# Altium schematic sheet S7CAS-PLEIADES-CARTE-MERE_P06_POWER2.SCHDOC
size Tabloid; SheetNumber: 5; SheetTotal: 18; Sheet_Name: POWER 2; Size: 11x17
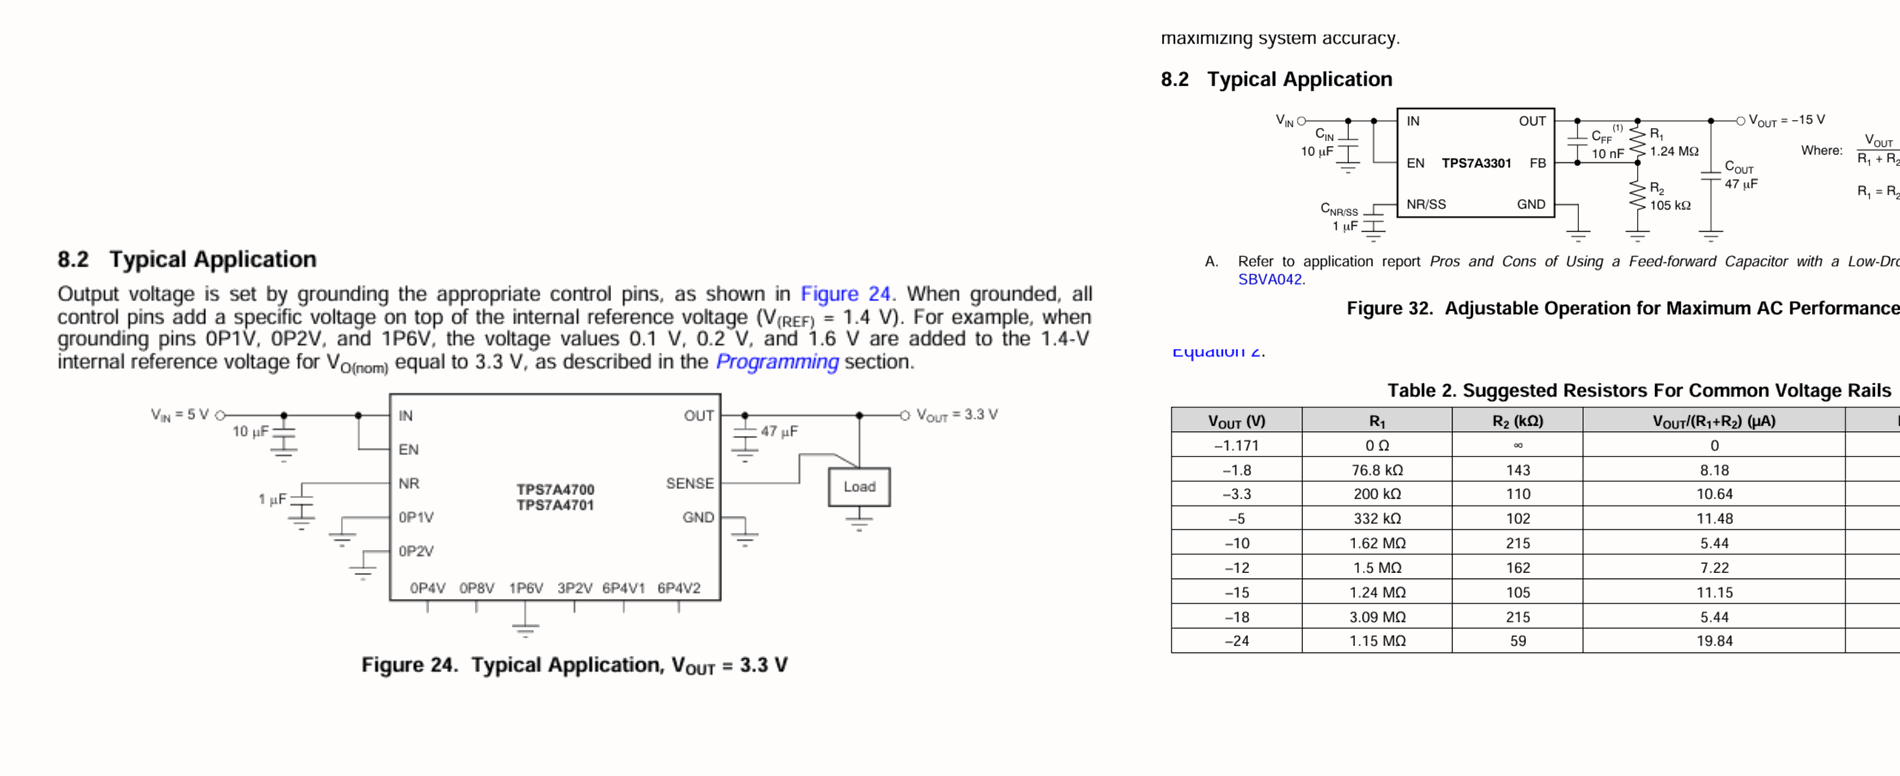
[diagram p0: S7CAS-PLEIADES-CARTE-MERE_P06_POWER2.SCHDOC, top left]
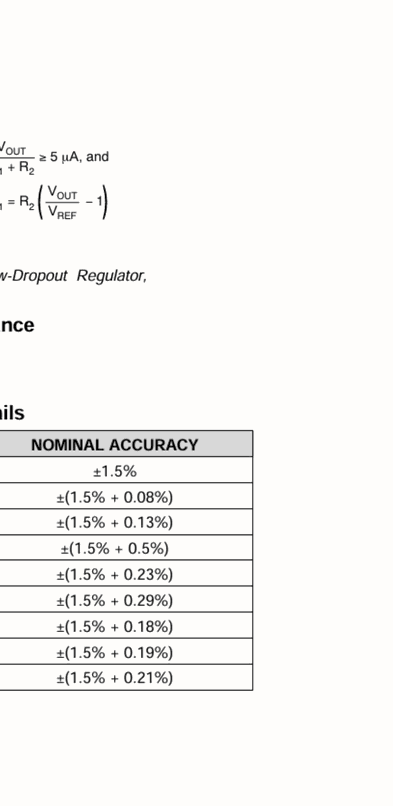
[diagram p1: S7CAS-PLEIADES-CARTE-MERE_P06_POWER2.SCHDOC, top right]
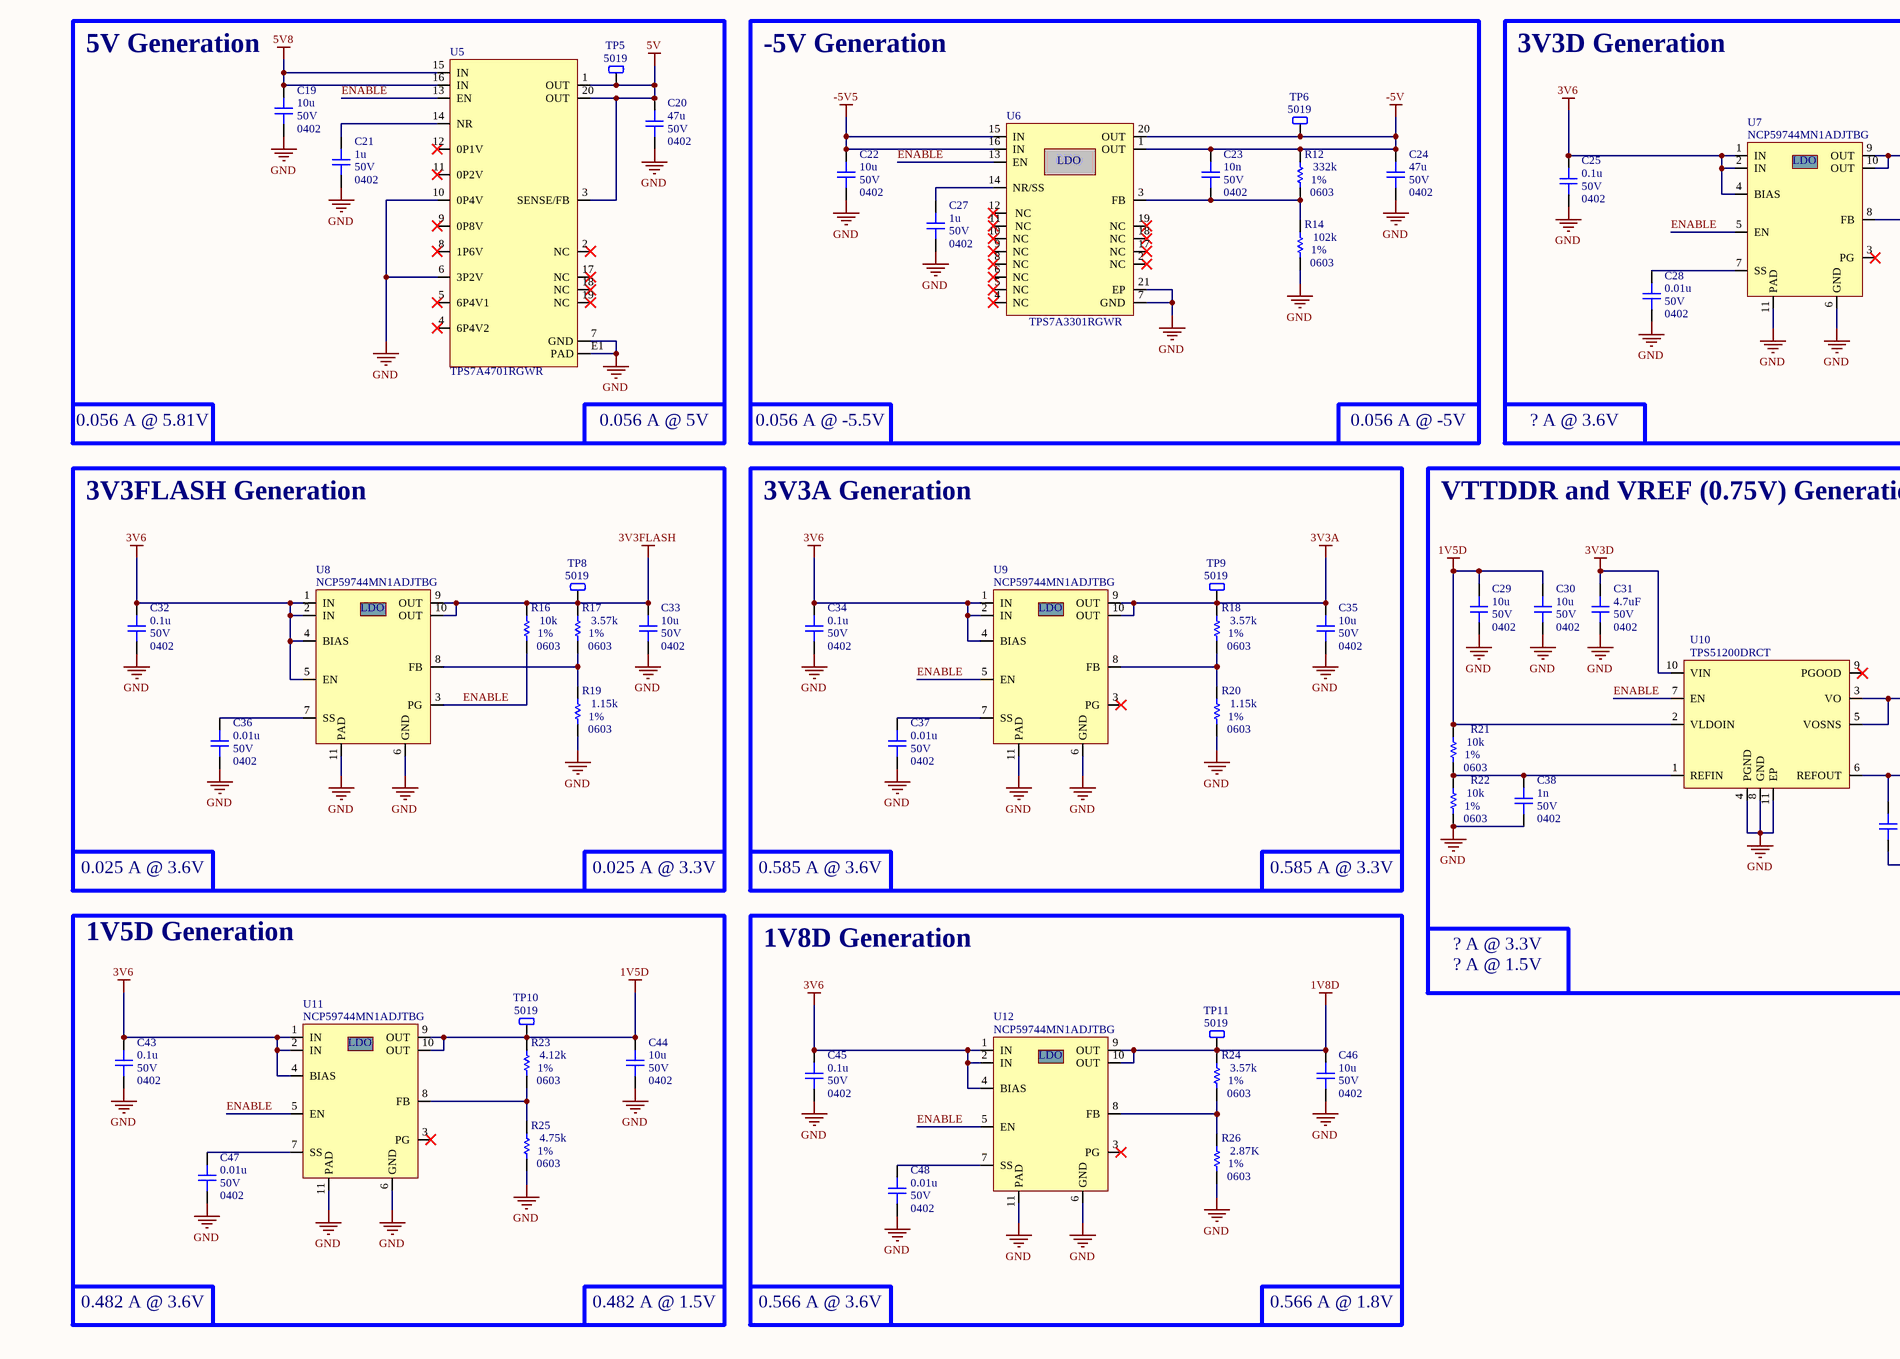
[diagram p2: S7CAS-PLEIADES-CARTE-MERE_P06_POWER2.SCHDOC, bottom left]
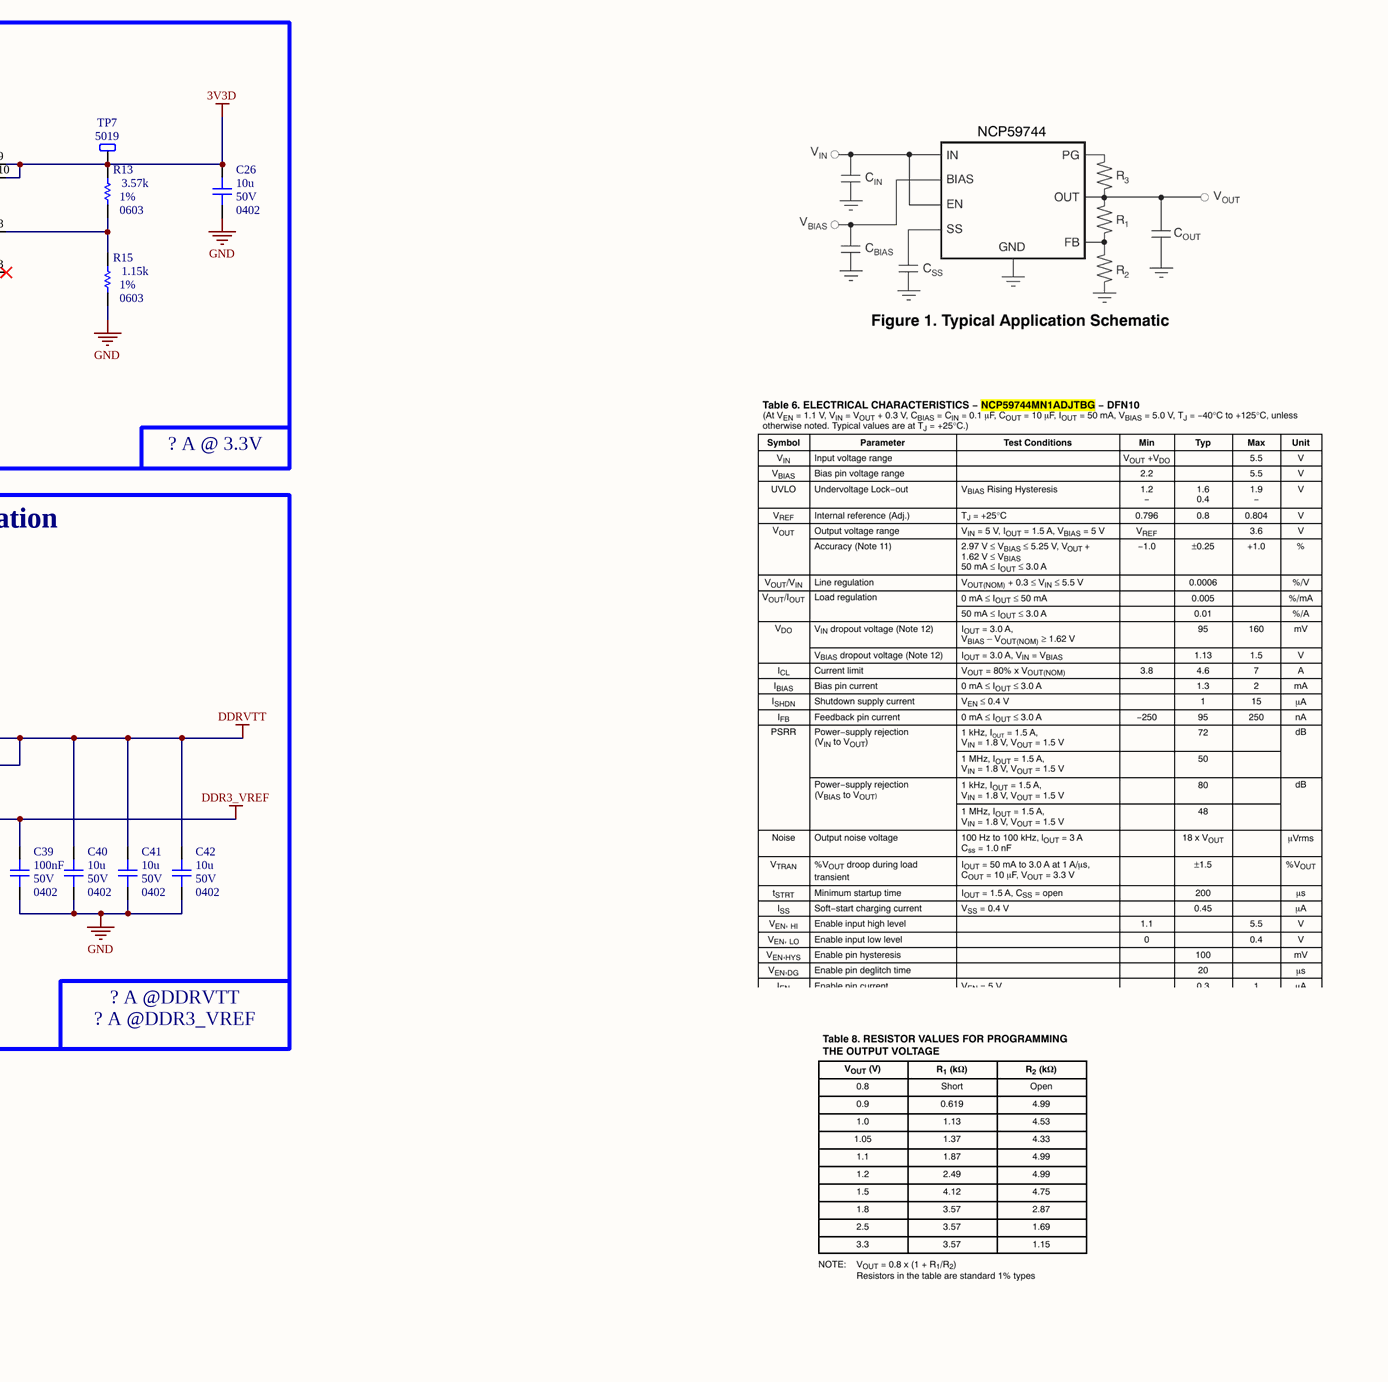
[diagram p3: S7CAS-PLEIADES-CARTE-MERE_P06_POWER2.SCHDOC, bottom right]

## Parts
C19  value 10u  Voltage: 50V  Package: 0402  [CAP_0402]  (hidden comment: CAP - 0402)
C20  value 47u  Voltage: 50V  Package: 0402  [CAP_0402]  (hidden comment: CAP - 0402)
C21  value 1u  Voltage: 50V  Package: 0402  [CAP_0402]  (hidden comment: CAP - 0402)
C22  value 10u  Voltage: 50V  Package: 0402  [CAP_0402]  (hidden comment: CAP - 0402)
C23  value 10n  Voltage: 50V  Package: 0402  [CAP_0402]  (hidden comment: CAP - 0402)
C24  value 47u  Voltage: 50V  Package: 0402  [CAP_0402]  (hidden comment: CAP - 0402)
C25  value 0.1u  Voltage: 50V  Package: 0402  [CAP_0402]  (hidden comment: CAP - 0402)
C26  value 10u  Voltage: 50V  Package: 0402  [CAP_0402]  (hidden comment: CAP - 0402)
C27  value 1u  Voltage: 50V  Package: 0402  [CAP_0402]  (hidden comment: CAP - 0402)
C28  value 0.01u  Voltage: 50V  Package: 0402  [CAP_0402]  (hidden comment: CAP - 0402)
C29  value 10u  Voltage: 50V  Package: 0402  [CAP_0402]  (hidden comment: CAP - 0402)
C30  value 10u  Voltage: 50V  Package: 0402  [CAP_0402]  (hidden comment: CAP - 0402)
C31  value 4.7uF  Voltage: 50V  Package: 0402  [CAP_0402]  (hidden comment: CAP - 0402)
C32  value 0.1u  Voltage: 50V  Package: 0402  [CAP_0402]  (hidden comment: CAP - 0402)
C33  value 10u  Voltage: 50V  Package: 0402  [CAP_0402]  (hidden comment: CAP - 0402)
C34  value 0.1u  Voltage: 50V  Package: 0402  [CAP_0402]  (hidden comment: CAP - 0402)
C35  value 10u  Voltage: 50V  Package: 0402  [CAP_0402]  (hidden comment: CAP - 0402)
C36  value 0.01u  Voltage: 50V  Package: 0402  [CAP_0402]  (hidden comment: CAP - 0402)
C37  value 0.01u  Voltage: 50V  Package: 0402  [CAP_0402]  (hidden comment: CAP - 0402)
C38  value 1n  Voltage: 50V  Package: 0402  [CAP_0402]  (hidden comment: CAP - 0402)
C39  value 100nF  Voltage: 50V  Package: 0402  [CAP_0402]  (hidden comment: CAP - 0402)
C40  value 10u  Voltage: 50V  Package: 0402  [CAP_0402]  (hidden comment: CAP - 0402)
C41  value 10u  Voltage: 50V  Package: 0402  [CAP_0402]  (hidden comment: CAP - 0402)
C42  value 10u  Voltage: 50V  Package: 0402  [CAP_0402]  (hidden comment: CAP - 0402)
C43  value 0.1u  Voltage: 50V  Package: 0402  [CAP_0402]  (hidden comment: CAP - 0402)
C44  value 10u  Voltage: 50V  Package: 0402  [CAP_0402]  (hidden comment: CAP - 0402)
C45  value 0.1u  Voltage: 50V  Package: 0402  [CAP_0402]  (hidden comment: CAP - 0402)
C46  value 10u  Voltage: 50V  Package: 0402  [CAP_0402]  (hidden comment: CAP - 0402)
C47  value 0.01u  Voltage: 50V  Package: 0402  [CAP_0402]  (hidden comment: CAP - 0402)
C48  value 0.01u  Voltage: 50V  Package: 0402  [CAP_0402]  (hidden comment: CAP - 0402)
R12  value 332k  Package: 0603  Precision: 1%  [RES_0603]  (hidden comment: RES - 0603)
R13  value 3.57k  Package: 0603  Precision: 1%  [RES_0603]  (hidden comment: RES - 0603)
R14  value 102k  Package: 0603  Precision: 1%  [RES_0603]  (hidden comment: RES - 0603)
R15  value 1.15k  Package: 0603  Precision: 1%  [RES_0603]  (hidden comment: RES - 0603)
R16  value 10k  Package: 0603  Precision: 1%  [RES_0603]  (hidden comment: RES - 0603)
R17  value 3.57k  Package: 0603  Precision: 1%  [RES_0603]  (hidden comment: RES - 0603)
R18  value 3.57k  Package: 0603  Precision: 1%  [RES_0603]  (hidden comment: RES - 0603)
R19  value 1.15k  Package: 0603  Precision: 1%  [RES_0603]  (hidden comment: RES - 0603)
R20  value 1.15k  Package: 0603  Precision: 1%  [RES_0603]  (hidden comment: RES - 0603)
R21  value 10k  Package: 0603  Precision: 1%  [RES_0603]  (hidden comment: RES - 0603)
R22  value 10k  Package: 0603  Precision: 1%  [RES_0603]  (hidden comment: RES - 0603)
R23  value 4.12k  Package: 0603  Precision: 1%  [RES_0603]  (hidden comment: RES - 0603)
R24  value 3.57k  Package: 0603  Precision: 1%  [RES_0603]  (hidden comment: RES - 0603)
R25  value 4.75k  Package: 0603  Precision: 1%  [RES_0603]  (hidden comment: RES - 0603)
R26  value 2.87K  Package: 0603  Precision: 1%  [RES_0603]  (hidden comment: RES - 0603)
TP5  5019  [TPO_SMD_5019]
TP6  5019  [TPO_SMD_5019]
TP7  5019  [TPO_SMD_5019]
TP8  5019  [TPO_SMD_5019]
TP9  5019  [TPO_SMD_5019]
TP10  5019  [TPO_SMD_5019]
TP11  5019  [TPO_SMD_5019]
U5  TPS7A4701RGWR  [REG_TPS7A4701RGWR]
U6  TPS7A3301RGWR  [REG_LDO_TPS7A3301RGWR]
U7  NCP59744MN1ADJTBG  [REG_LDO_NCP59744MN1ADJTBG]
U8  NCP59744MN1ADJTBG  [REG_LDO_NCP59744MN1ADJTBG]
U9  NCP59744MN1ADJTBG  [REG_LDO_NCP59744MN1ADJTBG]
U10  TPS51200DRCT  [REG_PMIC_TPS51200DRCT]
U11  NCP59744MN1ADJTBG  [REG_LDO_NCP59744MN1ADJTBG]
U12  NCP59744MN1ADJTBG  [REG_LDO_NCP59744MN1ADJTBG]

## Blocks framed on the sheet
5V Generation: C19-C21 TP5 U5
-5V Generation: C22-C24 C27 R12 R14 TP6 U6
3V3D Generation: C25 C26 C28 R13 R15 TP7 U7
3V3FLASH Generation: C32 C33 C36 R16 R17 R19 TP8 U8
3V3A Generation: C34 C35 C37 R18 R20 TP9 U9
VTTDDR and VREF (0.75V) Generation: C29-C31 C38-C42 R21 R22 U10
1V5D Generation: C43 C44 C47 R23 R25 TP10 U11
1V8D Generation: C45 C46 C48 R24 R26 TP11 U12

## Nets
1V5D: C29.2 C30.2 C44.2 R21.2 R23.2 TP10.1 U10.2(VLDOIN) U11.9(OUT) U11.10(OUT)
1V8D: C46.2 R24.2 TP11.1 U12.9(OUT) U12.10(OUT)
3V3A: C35.2 R18.2 TP9.1 U9.9(OUT) U9.10(OUT)
3V3D: C26.2 C31.2 R13.2 TP7.1 U7.9(OUT) U7.10(OUT) U10.10(VIN)
3V3FLASH: C33.2 R16.2 R17.2 TP8.1 U8.9(OUT) U8.10(OUT)
3V6: C25.2 C32.2 C34.2 C43.2 C45.2 U7.1(IN) U7.2(IN) U7.4(BIAS) U8.1(IN) U8.2(IN) U8.4(BIAS) U8.5(EN) U9.1(IN) U9.2(IN) U9.4(BIAS) U11.1(IN) U11.2(IN) U11.4(BIAS) U12.1(IN) U12.2(IN) U12.4(BIAS)
5V: C20.2 TP5.1 U5.1(OUT) U5.3(SENSE/FB) U5.20(OUT)
5V8: C19.2 U5.15(IN) U5.16(IN)
-5V: C23.2 C24.2 R12.2 TP6.1 U6.1(OUT) U6.20(OUT)
-5V5: C22.2 U6.15(IN) U6.16(IN)
DDR3_VREF: C39.2 U10.6(REFOUT)
DDRVTT: C40.2 C41.2 C42.2 U10.3(VO) U10.5(VOSNS)
GND: C19.1 C20.1 C21.1 C22.1 C24.1 C25.1 C26.1 C27.1 C28.1 C29.1 C30.1 C31.1 C32.1 C33.1 C34.1 C35.1 C36.1 C37.1 C38.1 C39.1 C40.1 C41.1 C42.1 C43.1 C44.1 C45.1 C46.1 C47.1 C48.1 R14.1 R15.1 R19.1 R20.1 R22.1 R25.1 R26.1 U5.6(3P2V) U5.7(GND) U5.10(0P4V) U5.E1(PAD) U6.7(GND) U6.21(EP) U7.6(GND) U7.11(PAD) U8.6(GND) U8.11(PAD) U9.6(GND) U9.11(PAD) U10.4(PGND) U10.8(GND) U10.11(EP) U11.6(GND) U11.11(PAD) U12.6(GND) U12.11(PAD)
ENABLE: R16.1 U5.13(EN) U6.13(EN) U7.5(EN) U8.3(PG) U9.5(EN) U10.7(EN) U11.5(EN) U12.5(EN)
NetC21_2: C21.2 U5.14(NR)
NetC23_1: C23.1 R12.1 R14.2 U6.3(FB)
NetC27_2: C27.2 U6.14(NR/SS)
NetC28_2: C28.2 U7.7(SS)
NetC36_2: C36.2 U8.7(SS)
NetC37_2: C37.2 U9.7(SS)
NetC38_2: C38.2 R21.1 R22.2 U10.1(REFIN)
NetC47_2: C47.2 U11.7(SS)
NetC48_2: C48.2 U12.7(SS)
NetR13_1: R13.1 R15.2 U7.8(FB)
NetR17_1: R17.1 R19.2 U8.8(FB)
NetR18_1: R18.1 R20.2 U9.8(FB)
NetR23_1: R23.1 R25.2 U11.8(FB)
NetR24_1: R24.1 R26.2 U12.8(FB)

Not connected (* = marked no-connect by the designer): U5 2(NC)* 4(6P4V2)* 5(6P4V1)* 8(1P6V)* 9(0P8V)* 11(0P2V)* 12(0P1V)* 17(NC)* 18(NC)* 19(NC)*; U6 2(NC)* 4(NC)* 5(NC)* 6(NC)* 8(NC)* 9(NC)* 10(NC)* 11(NC)* 12(NC)* 17(NC)* 18(NC)* 19(NC)*; U7 3(PG)*; U9 3(PG)*; U10 9(PGOOD)*; U11 3(PG)*; U12 3(PG)*

## Notes on the sheet
- 0.056 A @ 5.81V
- 0.056 A @ 5V
- 0.056 A @ -5.5V
- 0.056 A @ -5V
- ? A @ 3.6V
- ? A @ 3.3V
- 0.025 A @ 3.6V
- 0.025 A @ 3.3V
- 0.585 A @ 3.6V
- 0.585 A @ 3.3V
- ? A @ 3.3V
  ? A @ 1.5V
- ? A @DDRVTT
  ? A @DDR3_VREF
- 0.482 A @ 3.6V
- 0.482 A @ 1.5V
- 0.566 A @ 3.6V
- 0.566 A @ 1.8V
- Sheet Name
- Project Title
- Global Project
- Size
- Group
- Revision
- Date
- Sheet
- of
- Filename
- Designers
- (in symbol REG_LDO_NCP59744MN1ADJTBG) LDO
- (in symbol REG_LDO_TPS7A3301RGWR) LDO

## Library data of the parts
C19-C48 = CAP - 0402: Precision: 10%; Current: *; CreatedBy: Jonathan Bouchard; Power: *
TP5-TP11 = TPO_SMD_5019: TPO - PC TEST POINT MINI - SMD; Manufacturer #1: Keystone Electronics; Value: 3.81mm x 2.03mm; Polarized: No; Magnetic Material: UNKNOWN; GRAMS Lib Spec: 2.8; Current Rating: *; Manufacturer #2: *; Note: *; Power Max: *; Part Number #2: *; HelpURL: https://www.digikey.ca/product-detail/en/keystone-electronics/5019/36-5019CT-ND/3907344; Supplier 1: Digi-Key; Supplier Part Number 1: 36-5019CT-ND; Assembly Type: SMD; Part Number #1: 5019; Package: SMD; CreatedBy/Date: Olivier Bernard / 5/12/2017; Temperature: *; Tolerance: *; VerifiedBy: Caroline Paulin / 5 juillet 2018; Voltage Rating: *; Cryo: UNKNOWN
U5 = REG_LDO_TPS7A4701RGWR: REG - LINEAR POS ADJ 1A - 20VQFN; Manufacturer #1: Texas Instruments; GRAMS Lib Spec: 2.8; Magnetic Material: Unknown; Polarized: Yes; Value: 1.4 à 34V; Voltage rating: 35V max; Assembly Type: SMD; CreatedBy/Date: L-P Gauthier / 2018-05-29; Current Rating: 1A; Manufacturer #2: TBD; Part Number #1: TPS7A4701RGWR; Part Number #2: TBD; Package: 20-VQFN Exposed Pad; Power Max: *; Tolerance: -; Supplier 1: Digi-Key; Supplier Part Number 1: 296-37224-1-ND; VerifiedBy: Caroline Paulin - 28 sept 2018; Temperature: -40°C ~ 125°C; HelpURL: http://www.ti.com/lit/ds/symlink/tps7a47.pdf; Cryo: UNKNOWN
U6 = REG_LDO_TPS7A3301RGWR: REG - LDO Negative Adjustable 1 Output -1.18V-33V 1A -  20-VQFN (5x5); Manufacturer #1: Texas Instruments; Value: -1.18V~-33V; Voltage Rating: -36V; GRAMS Lib Spec: 2.8; Magnetic Material: Unknown; Polarized: Yes; Tolerance: *; Current Rating: 1A; Power Max: *; HelpURL: http://www.ti.com/lit/ds/symlink/tps7a33.pdf; CreatedBy/Date: Keven Deslandes - 2018/10/11; VerifiedBy: Caroline Paulin - 11/12/2018; Temperature: -40°C ~ 125°C; Package: 20-VQFN; Manufacturer #2: *; Assembly Type: SMD; Part Number #2: *; Part Number #1: TPS7A3301RGWR; Supplier 1: Digi-Key; Supplier Part Number 1: 296-39502-1-ND; Cryo: UNKNOWN
U7-U9 U11 U12 = REG_LDO_NCP59744MN1ADJTBG: REG - LINEAR POS ADJ 3A BIAS - 10-VFDFN; Manufacturer #1: ON Semiconductor; Value: 0.8V ~ 3.6V; Voltage Rating: (Vout+VDO) ~ 5.5V; Power Max: 10.8W; GRAMS Lib Spec: 2.8; Magnetic Material: Unknown; Polarized: Yes; Tolerance: -; Current Rating: 3A; HelpURL: https://www.onsemi.com/pub/Collateral/NCP59744-D.PDF; CreatedBy/Date: Raphael Bouchard / 2019-06-07; VerifiedBy: C.Paulin - 13/06/2019; Temperature: -40°C ~ 125°C (TJ); Package: 10-VFDFN; Manufacturer #2: -; Note: -; Assembly Type: SMD; Part Number #2: -; Part Number #1: NCP59744MN1ADJTBG; Supplier 1: Digi-Key; Supplier Part Number 1: NCP59744MN1ADJTBGOSCT-ND; Cryo: UNKNOWN
U10 = REG_PMIC_TPS51200DRCT: REG - DDR TERMINATION/REF REG - 10-VFDFN; Manufacturer #1: Texas Instruments; Value: DDR, DDR2, DDR3(L), DDR4; Voltage Rating: 2.375V ~ 3.5V; Current Rating: Source: 3A~4.5A, Sink: 3.5A~5.5A; GRAMS Lib Spec: 2.8; Magnetic Material: Unknown; Polarized: Yes; Tolerance: *; Power Max: *; HelpURL: http://www.ti.com/lit/ds/symlink/tps51200.pdf; CreatedBy/Date: Joel Lemay 2019-03-19; VerifiedBy: Nicolas V. (2019-05-31); Temperature: -40°C ~ 85°C; Package: 10-VFDFN; Manufacturer #2: *; Note: *; Assembly Type: SMD; Part Number #2: *; Part Number #1: TPS51200DRCT; Supplier 1: Digi-Key; Supplier Part Number 1: 296-23830-1-ND; Cryo: UNKNOWN
R12-R26 = RES - 0603: Current: *; CreatedBy: Jonathan Bouchard